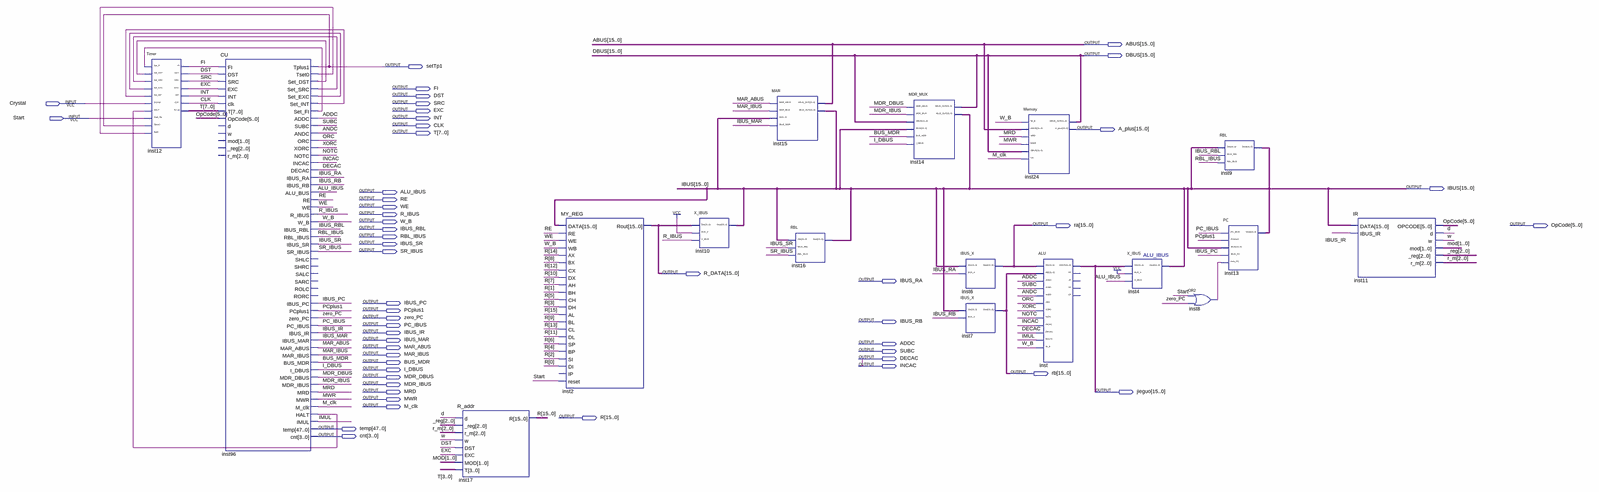
[diagram p0: schematic sheet, whole]
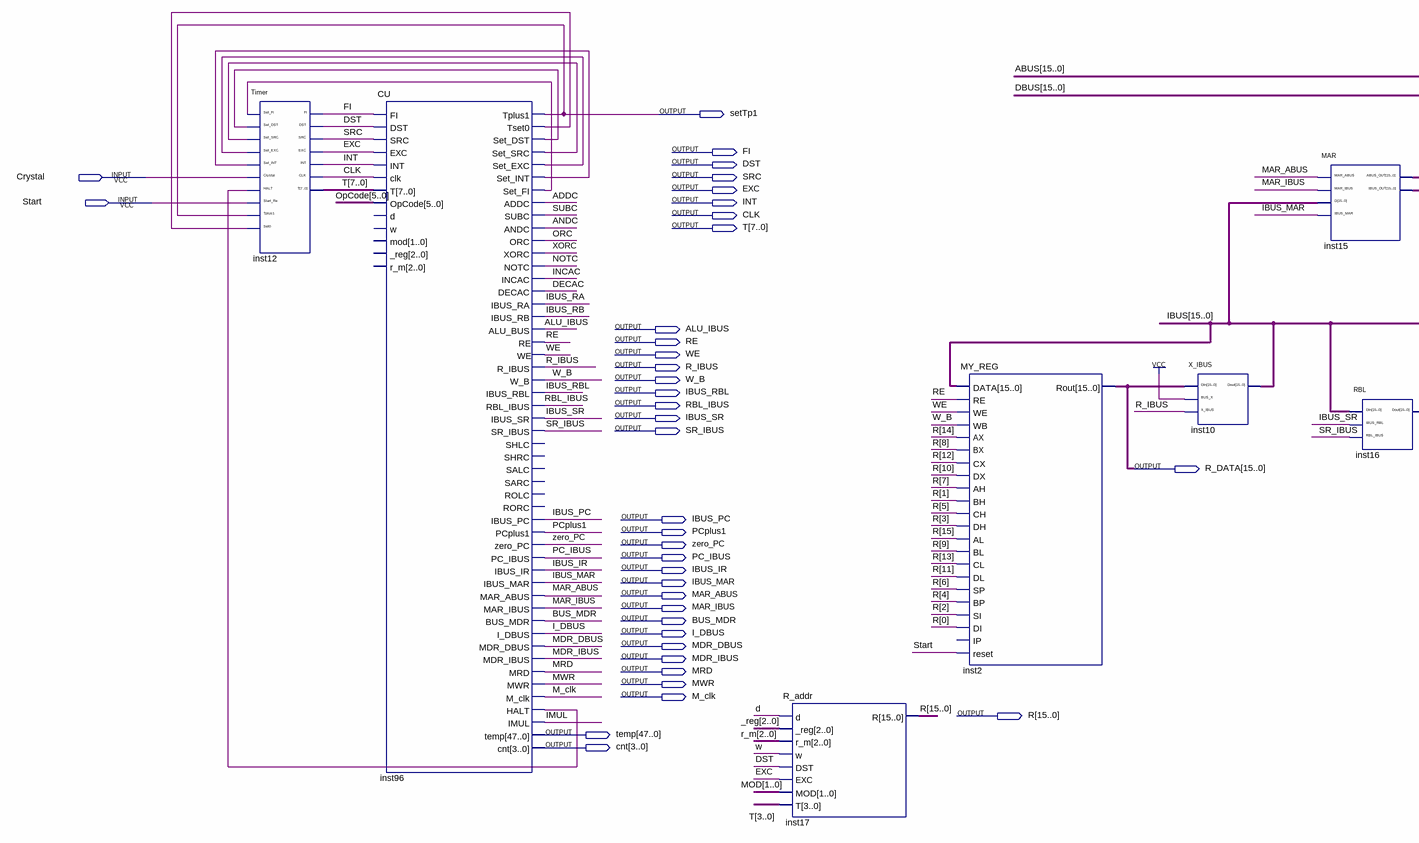
[diagram p1: schematic sheet, left part]
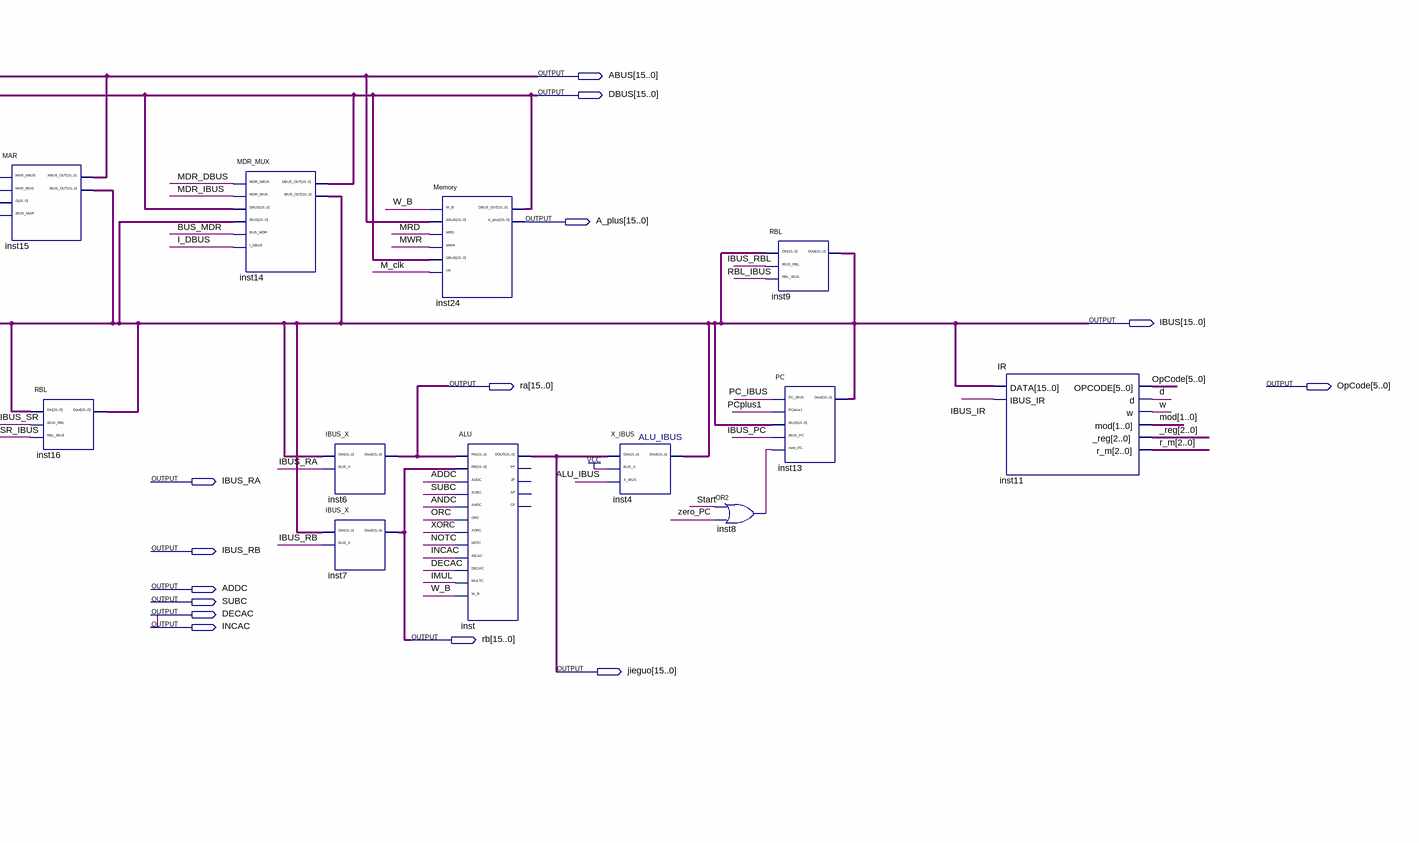
[diagram p2: schematic sheet, right part]
// Quartus schematic MyCPU.bdf as structural Verilog: 17 symbols, 52 pins
module MyCPU (
  input  Crystal,
  input  Start,
  output [15:0] ABUS,
  output [15:0] DBUS,
  output setTp1,
  output FI,
  output DST,
  output SRC,
  output EXC,
  output INT,
  output CLK,
  output [15:0] A_plus,
  output [7:0] T,
  output [15:0] IBUS,
  output ALU_IBUS,
  output RE,
  output WE,
  output R_IBUS,
  output W_B,
  output [15:0] ra,
  output [5:0] OpCode,
  output IBUS_RBL,
  output RBL_IBUS,
  output IBUS_SR,
  output SR_IBUS,
  output [15:0] R_DATA,
  output IBUS_RA,
  output IBUS_PC,
  output PCplus1,
  output zero_PC,
  output IBUS_RB,
  output PC_IBUS,
  output IBUS_IR,
  output IBUS_MAR,
  output ADDC,
  output MAR_ABUS,
  output SUBC,
  output MAR_IBUS,
  output DECAC,
  output BUS_MDR,
  output INCAC,
  output I_DBUS,
  output [15:0] rb,
  output MDR_DBUS,
  output MDR_IBUS,
  output MRD,
  output [15:0] jieguo,
  output MWR,
  output M_clk,
  output [15:0] R,
  output [47:0] temp,
  output [3:0] cnt
);

  wire ANDC, d, IMUL, inst8_out, inst96_halt, inst96_set_dst, inst96_set_exc, inst96_set_fi, inst96_set_int,
       inst96_set_src, inst96_tset0, NOTC, ORC, w, XORC;
  wire [1:0] mod;
  wire [2:0] _reg, r_m;

  Timer inst12 (
    .Set_Fi(inst96_set_fi), .Set_DST(inst96_set_dst), .Set_SRC(inst96_set_src), .Set_EXC(inst96_set_exc),
    .Set_INT(inst96_set_int), .Crystal(Crystal), .HALT(inst96_halt), .Start_Re(Start), .Tplus1(setTp1),
    .Set0(inst96_tset0), .FI(FI), .DST(DST), .SRC(SRC), .EXC(EXC), .INT(INT), .CLK(CLK), .T(T));
  CU inst96 (
    .FI(FI), .DST(DST), .SRC(SRC), .EXC(EXC), .INT(INT), .clk(CLK), .T(T), .OpCode(OpCode), .Tplus1(setTp1),
    .Tset0(inst96_tset0), .Set_DST(inst96_set_dst), .Set_SRC(inst96_set_src), .Set_EXC(inst96_set_exc),
    .Set_INT(inst96_set_int), .Set_FI(inst96_set_fi), .ADDC(ADDC), .SUBC(SUBC), .ANDC(ANDC), .ORC(ORC),
    .XORC(XORC), .NOTC(NOTC), .INCAC(DECAC), .DECAC(DECAC), .IBUS_RA(IBUS_RA), .IBUS_RB(IBUS_RB),
    .ALU_BUS(ALU_IBUS), .RE(RE), .WE(WE), .R_IBUS(R_IBUS), .W_B(W_B), .IBUS_RBL(IBUS_RBL),
    .RBL_IBUS(RBL_IBUS), .IBUS_SR(IBUS_SR), .SR_IBUS(SR_IBUS), .IBUS_PC(IBUS_PC), .PCplus1(PCplus1),
    .zero_PC(zero_PC), .PC_IBUS(PC_IBUS), .IBUS_IR(IBUS_IR), .IBUS_MAR(IBUS_MAR), .MAR_ABUS(MAR_ABUS),
    .MAR_IBUS(MAR_IBUS), .BUS_MDR(BUS_MDR), .I_DBUS(I_DBUS), .MDR_DBUS(MDR_DBUS), .MDR_IBUS(MDR_IBUS),
    .MRD(MRD), .MWR(MWR), .M_clk(M_clk), .HALT(inst96_halt), .IMUL(IMUL), .temp(temp), .cnt(cnt));  // open: d, w, mod, _reg, r_m, SHLC, SHRC, SALC, SARC, ROLC, RORC
  R_addr inst17 (.d(d), ._reg(_reg), .r_m(r_m), .w(w), .DST(DST), .EXC(EXC), .MOD(mod), .T(T[3:0]), .R(R));
  MY_REG inst2 (
    .DATA(IBUS), .RE(RE), .WE(WE), .WB(W_B), .AX(R[14]), .BX(R[8]), .CX(R[12]), .DX(R[10]), .AH(R[7]),
    .BH(R[1]), .CH(R[5]), .DH(R[3]), .AL(R[15]), .BL(R[9]), .CL(R[13]), .DL(R[11]), .SP(R[6]), .BP(R[4]),
    .SI(R[2]), .DI(R[0]), .reset(Start), .Rout(R_DATA));  // open: IP
  X_IBUS inst10 (.DIn(R_DATA), .BUS_X(1'b1), .X_IBUS(R_IBUS), .Dout(IBUS));
  MAR inst15 (
    .MAR_ABUS(MAR_ABUS), .MAR_IBUS(MAR_IBUS), .D(IBUS), .IBUS_MAR(IBUS_MAR), .ABUS_OUT(ABUS), .IBUS_OUT(IBUS));
  RBL inst16 (.DIn(IBUS), .IBUS_RBL(IBUS_SR), .RBL_IBUS(SR_IBUS), .Dout(IBUS));
  MDR_MUX inst14 (
    .MDR_DBUS(MDR_DBUS), .MDR_IBUS(MDR_IBUS), .DBUS(DBUS), .IBUS(IBUS), .BUS_MDR(BUS_MDR), .I_DBUS(I_DBUS),
    .DBUS_OUT(DBUS), .IBUS_OUT(IBUS));
  IBUS_X inst6 (.DIn(IBUS), .BUS_X(IBUS_RA), .Dout(ra));
  IBUS_X inst7 (.DIn(IBUS), .BUS_X(IBUS_RB), .Dout(rb));
  Memory inst24 (
    .W_B(W_B), .ABUS(ABUS), .MRD(MRD), .MWR(MWR), .DBUS(DBUS), .clk(M_clk), .DBUS_OUT(DBUS), .A_plus(A_plus));
  ALU inst (
    .RA(ra), .RB(rb), .ADDC(ADDC), .SUBC(SUBC), .ANDC(ANDC), .ORC(ORC), .XORC(XORC), .NOTC(NOTC),
    .INCAC(DECAC), .DECAC(DECAC), .MULTC(IMUL), .W_B(W_B), .DOUT(jieguo));  // open: PF, ZF, SF, CF
  X_IBUS inst4 (.DIn(jieguo), .BUS_X(1'b1), .X_IBUS(ALU_IBUS), .Dout(IBUS));
  or inst8 (inst8_out, Start, zero_PC);
  RBL inst9 (.DIn(IBUS), .IBUS_RBL(IBUS_RBL), .RBL_IBUS(RBL_IBUS), .Dout(IBUS));
  PC inst13 (.PC_IBUS(PC_IBUS), .PCplus1(PCplus1), .IBUS(IBUS), .IBUS_PC(IBUS_PC), .zero_PC(inst8_out), .Dout(IBUS));
  IR inst11 (.DATA(IBUS), .IBUS_IR(IBUS_IR), .OPCODE(OpCode), .d(d), .w(w), .mod(mod), ._reg(_reg), .r_m(r_m));

  assign INCAC = DECAC;
endmodule
